# Altium project Projet_finale.PrjPcb
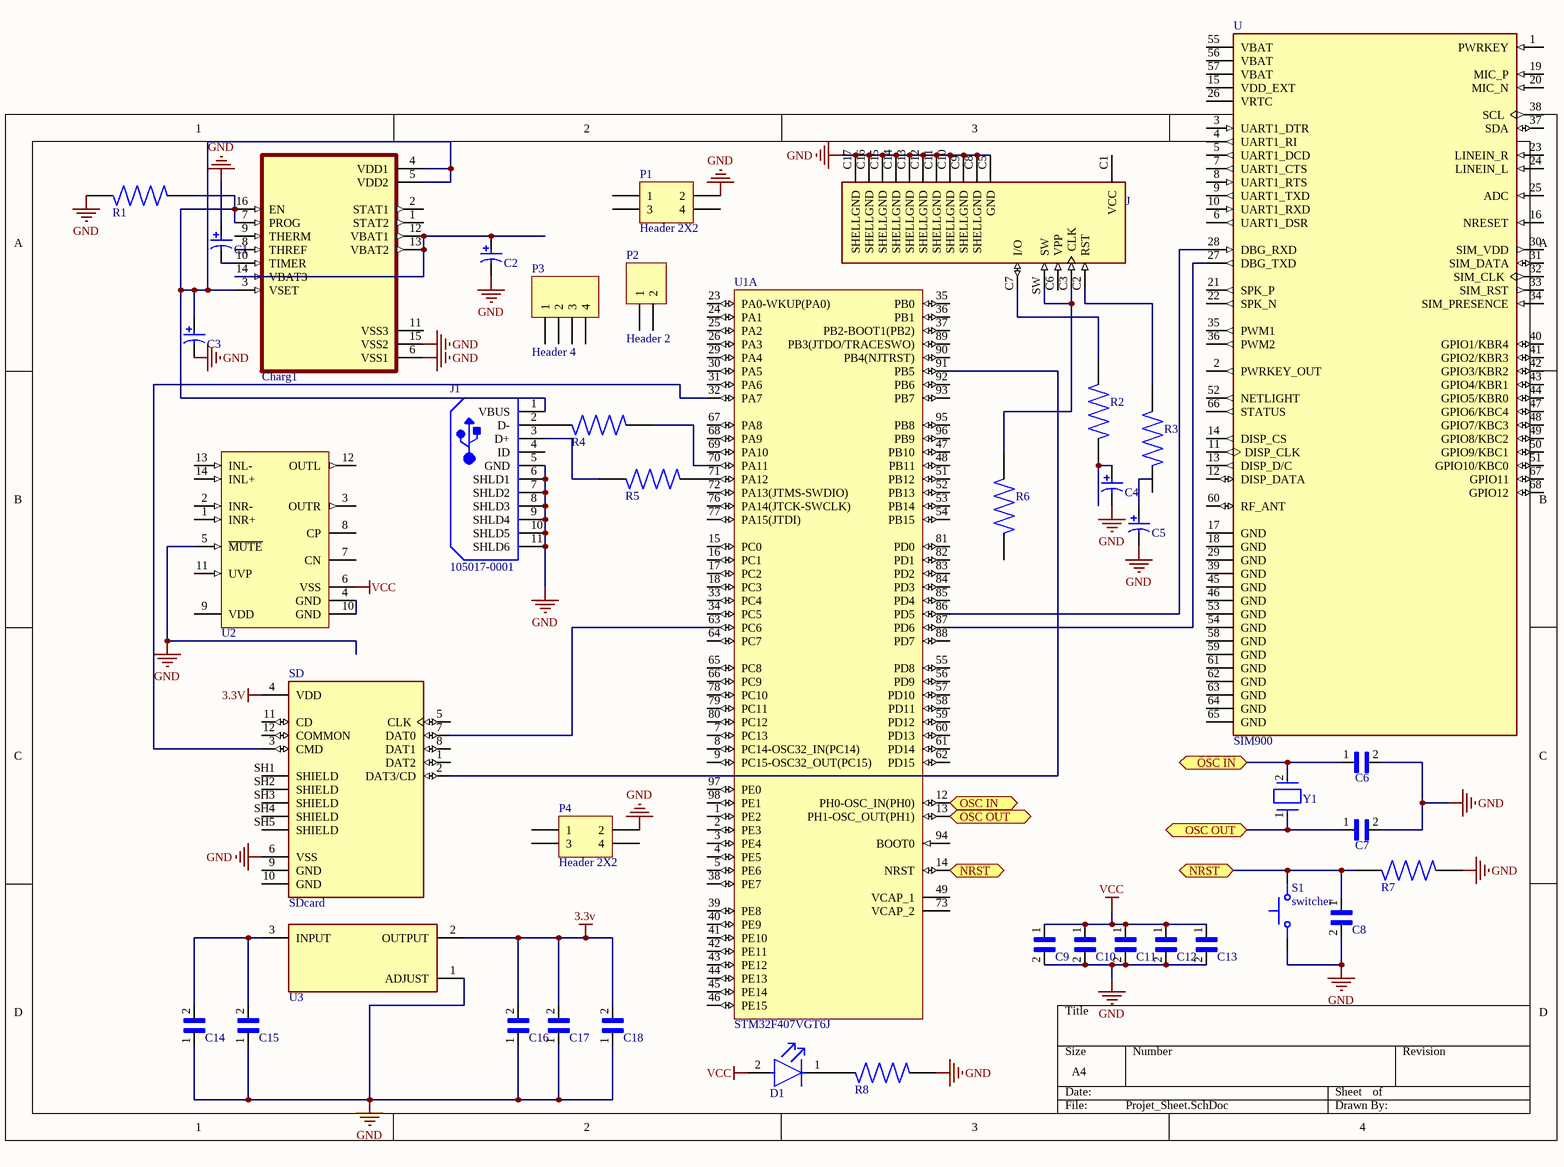
[diagram p0: Projet_Sheet.SchDoc]
1 sheet, 41 parts. Net scope: flat (ports and power ports of the same name join across sheets).
Board file: Projet_PCB.PcbDoc

## Sheet Projet_Sheet.SchDoc
size A4; SheetNumber: 1; SheetTotal: 1

### Parts
C1  EEE-1CA100SR  [Capacitor]  (value not drawn)
C2  EEE-1CA100SR  [Capacitor]  (value not drawn)
C3  EEE-1CA100SR  [Capacitor]  (value not drawn)
C4  EEE-1CA100SR  [Capacitor]  (value not drawn)
C5  EEE-1CA100SR  [Capacitor]  (value not drawn)
C6  capacitorrect  [CAPCRect]  (value not drawn)
C7  capacitorrect  [CAPCRect]  (value not drawn)
C8  capacitorrect  [CAPCRect]  (value not drawn)
C9  capacitorrect  [CAPCRect]  (value not drawn)
C10  capacitorrect  [CAPCRect]  (value not drawn)
C11  capacitorrect  [CAPCRect]  (value not drawn)
C12  capacitorrect  [CAPCRect]  (value not drawn)
C13  capacitorrect  [CAPCRect]  (value not drawn)
C14  capacitorrect  [CAPCRect]  (value not drawn)
C15  capacitorrect  [CAPCRect]  (value not drawn)
C16  capacitorrect  [CAPCRect]  (value not drawn)
C17  capacitorrect  [CAPCRect]  (value not drawn)
C18  capacitorrect  [CAPCRect]  (value not drawn)
Charg1  chargeur li  [chargeurli]  (value not drawn)
D1  HLMP-4700  [Led]  (value not drawn)
J  Simcard  [Simconnector]  (value not drawn)
J1  105017-0001  [USB-MICRO-B_V]
P1  Header 2X2  [HDR2X2]
P2  Header 2  [HDR1X2]
P3  Header 4  [HDR1X4]
P4  Header 2X2  [HDR2X2]
R1  RESISTORTH  [RESTH]  (value not drawn)
R2  RESISTORTH  [RESTH]  (value not drawn)
R3  RESISTORTH  [RESTH]  (value not drawn)
R4  RESISTORTH  [RESTH]  (value not drawn)
R5  RESISTORTH  [RESTH]  (value not drawn)
R6  RESISTORTH  [RESTH]  (value not drawn)
R7  RESISTORTH  [RESTH]  (value not drawn)
R8  RESISTORTH  [RESTH]  (value not drawn)
S1  switcher  [switcher]
SD  SDcard  [SD]
U  SIM900  [sim900]
U1  STM32F407VGT6J  [Stm32]  (part A of 2)
U2  TPA6138A2PWR  [audio]  (value not drawn)
U3  LM317KCT  [LM317]  (value not drawn)
Y1  ABS07-166-32.768KHZ-T  [XTAL]  (value not drawn)

### Ports
NRST (bidir), OSC IN (bidir), OSC OUT (bidir)

### Nets
3.3v: C16.2 C17.2 C18.2 SD.4(VDD) U3.2(OUTPUT)
GND: C1.1 C2.2 C3.2 C4.2 C5.2 C6.2 C7.2 C8.2 C9.2 C10.2 C11.2 C12.2 C13.2 C14.1 C15.1 C16.1 C17.1 C18.1 Charg1.6(VSS1) Charg1.15(VSS2) J.C5(GND) J.C8(SHELLGND) J.C9(SHELLGND) J.C10(SHELLGND) J.C11(SHELLGND) J.C12(SHELLGND) J.C13(SHELLGND) J.C14(SHELLGND) J.C15(SHELLGND) J.C16(SHELLGND) J.C17(SHELLGND) J1.5(GND) J1.6(SHLD1) J1.7(SHLD2) J1.8(SHLD3) J1.9(SHLD4) J1.10(SHLD5) J1.11(SHLD6) P1.2 P4.2 R1.2 R7.1 R8.1 S1.1 SD.6(VSS) U2.5(~{MUTE}) U3.1(ADJUST)
VCC: C9.1 C10.1 C11.1 C12.1 C13.1 D1.2(A) U2.6(VSS)
NetC1_2: C1.2 Charg1.10(TIMER)
NetC2_1: C2.1 Charg1.12(VBAT1) Charg1.13(VBAT2) Charg1.14(VBAT3)
NetC3_1: C3.1 Charg1.3(VSET) Charg1.4(VDD1) Charg1.5(VDD2) Charg1.7(PROG) Charg1.16(EN) J1.1(VBUS) R1.1
NetC4_1: C4.1 R2.2
NetC6_1: C6.1 U1.12(PH0-OSC_IN(PH0)) Y1.2 ; port OSC IN
NetC7_1: C7.1 U1.13(PH1-OSC_OUT(PH1)) Y1.1 ; port OSC OUT
NetC8_1: C8.1 R7.2 S1.2 U1.14(NRST) ; port NRST
NetC14_2: C14.2 C15.2 U3.3(INPUT)
NetD1_1: D1.1(C) R8.2
NetJ1_2: J1.2(D-) R4.2
NetJ1_3: J1.3(D+) R5.2
NetJ_C2: J.C2(RST) R3.1
NetJ_C3: J.C3(CLK) J.SW R6.1
NetJ_C7: J.C7(I/O) R2.1
NetR4_1: R4.1 U1.70(PA11)
NetR5_1: R5.1 U1.71(PA12)
NetSD_2: SD.2(DAT3/CD) U1.91(PB5)
NetSD_3: SD.3(CMD) U1.32(PA7)
NetSD_7: SD.7(DAT0) U1.63(PC6)
NetU2_4: U2.4(GND) U2.10(GND)
NetU_27: U.27(DBG_TXD) U1.87(PD6)
NetU_28: U.28(DBG_RXD) U1.86(PD5)

Not connected (* = marked no-connect by the designer): C5 1; Charg1 1(STAT2) 2(STAT1) 8(THREF) 9(THERM) 11(VSS3); J C1(VCC) C6(VPP); J1 4(ID); P1 1 3 4; P2 1 2; P3 1 2 3 4; P4 1 3 4; R3 2; R6 2; SD 1(DAT2) 5(CLK) 8(DAT1) 9(GND) 10(GND) 11(CD) 12(COMMON) SH1(SHIELD) SH2(SHIELD) SH3(SHIELD) SH4(SHIELD) SH5(SHIELD); U 1(PWRKEY) 2(PWRKEY_OUT) 3(UART1_DTR) 4(UART1_RI) 5(UART1_DCD) 6(UART1_DSR) 7(UART1_CTS) 8(UART1_RTS) 9(UART1_TXD) 10(UART1_RXD) 11(DISP_CLK) 12(DISP_DATA) 13(DISP_D/C) 14(DISP_CS) 15(VDD_EXT) 16(NRESET) 17(GND) 18(GND) 19(MIC_P) 20(MIC_N) 21(SPK_P) 22(SPK_N) 23(LINEIN_R) 24(LINEIN_L) 25(ADC) 26(VRTC) 29(GND) 30(SIM_VDD) 31(SIM_DATA) 32(SIM_CLK) 33(SIM_RST) 34(SIM_PRESENCE) 35(PWM1) 36(PWM2) 37(SDA) 38(SCL) 39(GND) 40(GPIO1/KBR4) 41(GPIO2/KBR3) 42(GPIO3/KBR2) 43(GPIO4/KBR1) 44(GPIO5/KBR0) 45(GND) 46(GND) 47(GPIO6/KBC4) 48(GPIO7/KBC3) 49(GPIO8/KBC2) 50(GPIO9/KBC1) 51(GPIO10/KBC0) 52(NETLIGHT) 53(GND) 54(GND) 55(VBAT) 56(VBAT) 57(VBAT) 58(GND) 59(GND) 60(RF_ANT) 61(GND) 62(GND) 63(GND) 64(GND) 65(GND) 66(STATUS) 67(GPIO11) 68(GPIO12); U1 1(PE2) 2(PE3) 3(PE4) 4(PE5) 5(PE6) 7(PC13) 8(PC14-OSC32_IN(PC14)) 9(PC15-OSC32_OUT(PC15)) 15(PC0) 16(PC1) 17(PC2) 18(PC3) 23(PA0-WKUP(PA0)) 24(PA1) 25(PA2) 26(PA3) 29(PA4) 30(PA5) 31(PA6) 33(PC4) 34(PC5) 35(PB0) 36(PB1) 37(PB2-BOOT1(PB2)) 38(PE7) 39(PE8) 40(PE9) 41(PE10) 42(PE11) 43(PE12) 44(PE13) 45(PE14) 46(PE15) 47(PB10) 48(PB11) 49(VCAP_1) 51(PB12) 52(PB13) 53(PB14) 54(PB15) 55(PD8) 56(PD9) 57(PD10) 58(PD11) 59(PD12) 60(PD13) 61(PD14) 62(PD15) 64(PC7) 65(PC8) 66(PC9) 67(PA8) 68(PA9) 69(PA10) 72(PA13(JTMS-SWDIO)) 73(VCAP_2) 76(PA14(JTCK-SWCLK)) 77(PA15(JTDI)) 78(PC10) 79(PC11) 80(PC12) 81(PD0) 82(PD1) 83(PD2) 84(PD3) 85(PD4) 88(PD7) 89(PB3(JTDO/TRACESWO)) 90(PB4(NJTRST)) 92(PB6) 93(PB7) 94(BOOT0) 95(PB8) 96(PB9) 97(PE0) 98(PE1); U2 1(INR+) 2(INR-) 3(OUTR) 7(CN) 8(CP) 9(VDD) 11(UVP) 12(OUTL) 13(INL-) 14(INL+)

### Library data of the parts
C1-C5 = Capacitor: Aluminum Electrolytic Capacitor, 10 uF, +/- 20%, -40 to 85 degC, 2-Pin SMD, RoHS, Tape and Reel; Manufacturer: Panasonic; Lead Length: 1.8mm; No. of Pins: 2; Ripple Current Frequency: 120Hz; Ripple Current Temperature: 85°C; External Depth: 4.3mm; Operating Lifetime: 2000h; Power Factor: 0.16; Lead Cross-section Width: 0.65mm; Product Range: PANASONIC-SSeries; Voltage Rating V DC: 16V; Leakage Current: 3µA; Ripple Current AC: 28mA; AE Capacitor Case: RadialCan-SMD; Capacitance: 10µF; Lifetime @ Temperature: 2000hours@85°C; External Length / Height: 5.4mm; SVHC: NoSVHC(16-Dec-2013); Packaging: CutTape; Series: VS; Package Description: 2-Pin Surface Mount Device, Body 4.5 x 4.5 mm; Tolerance -: 20%; Capacitor Terminals: SMD; Lead Spacing: 1mm; Package / Case: B; Capacitance Tolerance: ±20%; Operating life Time: 2000h; Tape Width: 12mm; Power Factor Frequency: 120Hz; Voltage Rating: 16V; Diameter: 4mm; Operating Temperature Max: 85°C; Datasheet URL: https://datasheet.ciiva.com/19458/1355487-19458346.pdf; Capacitor Mounting: SMD; External Width: 4.3mm; Operating Life Temperature: 85°C; Capacitance Tolerance ±: ±20%; Package Reference: EEE1CA100SR; AC Ripple Current: 28mA; Tolerance +: 20%; Height: 5.4mm; Datasheet Version: 04/2005; Operating Temperature Min: -40°C; Capacitor Case Style: RadialCan-SMD; Mounting Technology: SurfaceMount; Operating Temperature Range: -40°Cto+85°C; Manufacturer URL: http://www.panasonic.com/; Life Time @ Temperature: 2000hours@85°C
C6-C18 = capacitorrect: Tantalum Capacitors; MF: AVX; MP: TBJA475K020RBLC0024; SnapEDA_Link: https://www.snapeda.com/parts/TBJA475K020RBLC0024/AVX/view-part/1734994/?ref=snap; Price: None; Availability: Unavailable; Value: *; Package: 1206 AVX
Charg1 = chargeur li: MP: MCP73861-I/SL; Package: None; Price: None; Value: *; Availability: Unavailable
D1 = led: LED RED DIFFUSED T-1 3/4 T/H; Manufacturer: Broadcom; Luminous Intensity: 2.3mcd; Peak Emmision Wavelength: 635nm; Forward Voltage: 1.7V; Viewing Angle: 50°; Led Orientation: Straight; Reverse Voltage: 5V; Forward Current: 2mA; Power Dissipation: 14mW; Wavelength: 626nm; Digikey Description: LED RED DIFFUSED T-1 3/4 T/H; Device Class L3: unset; Temperature Range Low: -40°C; Temperature Range High: +100°C; RoHS: TRUE; Package: HLMP-4700; Octopart: https://octopart.com/hlmp-4700-broadcom-71130526; Automotive: No; ComponentLink2URL: https://docs.broadcom.com/docs/AV02-1557EN; Colour: Red; Temperature: -40°C to +100°C; Lead Free: Yes; Category: Diode; ComponentLink2Description: Datasheet; Manufacturer Part Number: HLMP-4700; Device Class L1: Optoelectronics; Device Class L2: LEDs; Mouser Description: LED; Red; 2.3mcd; 0.24In.Dia.; T-1-3/4; 500mA; 1.7V; 635nm; 50deg; 5V; 24mW; -55degC;
J = Simcard: CONNECTOR, SIM SOCKET, 6POS, 2.54MM; Connector Type:SIM Socket; Series:2174803;; Number_of_Positions: 6; MP: 2174803-2; Voltage_Rating: 10 VAC; Centerline_Pitch: 2.54 mm[.1 in]; MF: TE Connectivity; TE_purchase_URL: https://www.te.com/usa-en/product-2174803-2.html?te_bu=Cor&te_type=disp&te_campaign=seda_glo_cor-seda-global-disp-prtnr-fy19-seda-model-bom-cta_sma-317_1&elqCampaignId=32493; Product_Type: Connector; Package: None; SnapEDA_Link: https://www.snapeda.com/parts/2174803-2/TE%20Connectivity%20AMP%20Connectors/view-part/47676/?ref=snap; Availability: Unavailable; Value: *; EU_RoHS_Compliance: Compliant; Price: None
J1 = USB: Micro-USB B Receptacle, Right Angle, Bottom Mount, Surface Mount, with Solder Tabs, -30 to 85 degC, 5-Pin USB, RoHS, Tape and Reel; Manufacturer: Molex; Featured Product: Micro-USBConnectorsUSBConnectors; Other Names: WM1399DKR; Package Version: Rev. F, 12/2012; Number of Contacts: 5; Connector Type: USB-microB; Catalog Drawings: 1050170001; 3D Model: 105017-0001.stp; Mating Products: WM17145-ND-CABLEMICROUSBBTOSTDA1.0MWM17147-ND-CABLEMICROUSBBTOSTDA2.0MWM17146-ND-CABLEMICROUSBBTOSTDA1.5M; PCN Assembly/Origin: ResinSupplier21/Oct/2015; Voltage - Max: 30V; Online Catalog: Molex-MicroUSB; Manufacturer URL: http://www.molex.com/; Package Description: 5-Leads USB, Micro B, Body 7.5 x 5 mm, Pitch 0.65 mm; Datasheet URL: http://www.molex.com/elqNow/elqRedir.htm?ref=http://www.molex.com/webdocs/datasheets/pdf/en-us/1050170001_IO_CONNECTORS.pdf; Ingress Protection: -; Datasheet Version: 03/2016; Mounting Type: BoardCutout,SurfaceMount,RightAngle; Circuits: 5; Standard Package: 1; Package Reference: MICRO-B; Package URL: http://www.molex.com/pdm_docs/sd/1050170001_sd.pdf; Category: Connectors,Interconnects; Series: -; RoHS Information: 1050170001CertofCompliance; Features: Shielded,SolderRetention; Family: USB,DVI,HDMIConnectors; Specifications: -; Gender: Receptacle; Packaging: Digi-Reel®; Mounting Technology: SurfaceMount
P1 P4 = Header 2X2: Header, 2-Pin, Dual row; LatestRevisionDate: 17-Jul-2002; LatestRevisionNote: Re-released for DXP Platform.; Publisher: Altium Limited
P2 = Header 2: Header, 2-Pin; LatestRevisionDate: 17-Jul-2002; LatestRevisionNote: Re-released for DXP Platform.; Publisher: Altium Limited
P3 = Header 4: Header, 4-Pin; LatestRevisionDate: 17-Jul-2002; LatestRevisionNote: Re-released for DXP Platform.; Publisher: Altium Limited
R1-R8 = RESISTORTH: 10.2 kOhms Â±1% 0.25W, 1/4W Through Hole Resistor Axial - Metal Film; MF: Yageo; MP: MFR-25FBF52-10K; SnapEDA_Link: https://www.snapeda.com/parts/MFR-25FBF52-10K/Yageo/view-part/?ref=snap; Availability: In Stock; Price: None; Value: *; Check_prices: https://www.snapeda.com/parts/MFR-25FBF52-10K/Yageo/view-part/?ref=eda; Purchase-URL: https://pricing.snapeda.com/search/part/MFR-25FBF52-10K/?ref=eda; Package: Axial Yageo
S1 = switcher: SWITCH TACTILE SPST-NO 0.05A 12V; MF: E-Switch; MP: TL59NF160Q; Purchase-URL: https://pricing.snapeda.com/search/part/TL59NF160Q/?ref=eda; Package: None; Value: *; SnapEDA_Link: https://www.snapeda.com/parts/TL59NF160Q/E-Switch/view-part/?ref=snap; Check_prices: https://www.snapeda.com/parts/TL59NF160Q/E-Switch/view-part/?ref=eda; Price: None; Availability: In Stock
SD = SDcard: microSD Memory Card Push-push Type SCHA Series; MP: SCHA4B0419; MF: ALPS; Value: *; SnapEDA_Link: https://www.snapeda.com/parts/SCHA4B0419/ALPS/view-part/455281/?ref=snap; Availability: Unavailable; Price: None; Package: None
U = SIM900: LPC11U00 GPRS/GSM For Use With LPC11U37, SIM900, mbed-Enabled Development; MF: Seeed Technology; Package: DIP-60 Simcom; Availability: Unavailable; MP: SIM900; Value: *; SnapEDA_Link: https://www.snapeda.com/parts/SIM900/Seeed%20Technology%20Co.%2C%20Ltd/view-part/105877/?ref=snap; Price: None
U1 = Stm: ARM Cortex-M4 32-bit MCU+FPU, 210 DMIPS, 1024 kB Flash, 192 kB Internal RAM, 82 I/Os, 100-pin LQFP, -40 to 85 degC, Tray; Manufacturer: STMicroelectronics; Internal RAM Size (kB): 192; Operating Frequency(F) (Processor speed) (MHz): 168; FLASH Size (Prog) (kB): 1024; I/Os (High Current): 82; Supply Voltage(Vcc) max (V): 3.6; D/A Converter: 2x12-bit; Supply Voltage(Vcc) min (V): 1.8; PackageReference: LQFP100; ComponentLink2URL: http://www.st.com/st-web-ui/static/active/en/resource/technical/document/datasheet/DM00037051.pdf; Packing: Tray; ComponentLink3Description: Package Specification; PackageDescription: 100-Pin Low Profile Quad Flat Package, 14 x 14 mm Body, 0.5 mm Pitch; PackageVersion: Rev. 1, 06/2013; ComponentLink1Description: Manufacturer URL; PartNumber: STM32F407VGT6J; Core: ARM Cortex-M4; ComponentLink2Description: Datasheet; ComponentLink1URL: http://www.st.com/web/en/home.html; Mounting Technology: Surface Mount; DatasheetVersion: Rev. 4; ComponentLink3URL: http://www.st.com/st-web-ui/static/active/en/resource/technical/document/data_brief/DM00071938.pdf
U2 = AUDIO: DirectPath(TM) Headphone Driver with Adjustable Gain, -40 to 85 degC, 14-pin SOP (PW14), Green (RoHS & no Sb/Br); Manufacturer: Texas Instruments; Headphone Channels: Stereo; PSRR(dB): 80; Half Power THD + N @ 1 kHz (%)(kHz): 0.01; SubFamily: Headphone Amplifier; Ground-Centered Outputs: Yes; Output Power(W): 0.04; Load(Min)(ohms): 16; Supply Min(Min)(Volt): 3; Supply Max(Max)(Volt): 3.6; Mounting Technology: Surface Mount; PackageVersion: 4040064-3/G, 02/2011; ComponentLink1Description: Manufacturer URL; PackageDescription: 14-Pin Plastic Small Outline, Body 5 x 4.4 mm, Pitch 0.65 mm; Eco-Plan: Green (RoHS & no Sb/Br); DatasheetVersion: SLOS704A; ComponentLink2URL: http://www.ti.com/general/docs/lit/getliterature.tsp?genericPartNumber=TPA6138A2&fileType=pdf; Special Features: Adjustable Gain; PackageReference: PW0014A; ComponentLink3Description: Package Specification; ComponentLink3URL: http://www.ti.com/litv/pdf/mpds360; Code_JEDEC: MO-153; ComponentLink2Description: Datasheet; PartNumber: TPA6138A2PWR; ComponentLink1URL: http://www.ti.com/
U3 = Regulateur: IC REG LIN POS ADJ 1.5A TO220-3; Power Supply Rejection Ratio (PSRR): 57dB; Output Voltage: 37V; Number of Regulators: 1; Polarity: Positive; Power Rating: 20W; Max Input Voltage: 40V; Min Input Voltage: 4.2V; Min Output Voltage: 1.25V; Quiescent Current: 3.5mA; Dropout Voltage: 2V; Output Type: Adjustable; Lead Free: Lead Free; RoHS Compliant: Yes; Number of Outputs: 1; Mount: Through Hole; Height: 16.51mm; Weight: 0.211644oz; Max Operating Temperature: 125°C; Number of Pins: 3; Max Output Voltage: 37V; Packaging: Rail/Tube; REACH SVHC: No SVHC; Width: 4.65mm; Case/Package: TO-220; Min Operating Temperature: 0°C; Length: 10.67mm; Reference Voltage: 1.25V; Series: LM317; Max Output Current: 1.5A; Output Current: 1.5A; Package Quantity: 50; Radiation Hardening: No
Y1 = XTAL: CRYSTAL 32.7680KHZ 7PF SMD; Frequency Tolerance: 10ppm; ESR (Equivalent Series Resistance): 70kR; Min Operating Temperature: -40°C; RoHS Compliant: Yes; Max Operating Temperature: 85°C; Packaging: Tape and Reel; Case/Package: SMD/SMT; Load Capacitance: 7pF; Mount: Surface Mount; Frequency: 32.768kHz